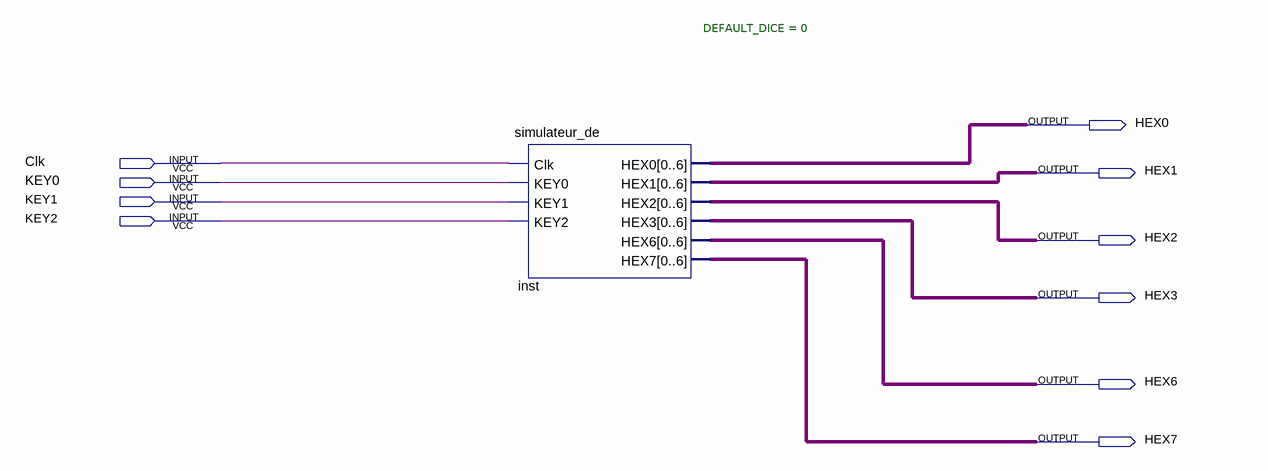
[diagram p0: schematic sheet]
// Quartus schematic Block1.bdf as structural Verilog: 1 symbols, 10 pins
module Block1 (
  input  Clk,
  input  KEY0,
  input  KEY1,
  input  KEY2,
  output HEX0,
  output HEX1,
  output HEX2,
  output HEX3,
  output HEX6,
  output HEX7
);

  wire [6:0] inst_hex0, inst_hex1, inst_hex2, inst_hex3, inst_hex6, inst_hex7;

  simulateur_de #(.DEFAULT_DICE(0)) inst (
    .Clk(Clk), .KEY0(KEY0), .KEY1(KEY1), .KEY2(KEY2), .HEX0(inst_hex0), .HEX1(inst_hex1), .HEX2(inst_hex2),
    .HEX3(inst_hex3), .HEX6(inst_hex6), .HEX7(inst_hex7));
endmodule
